# EAGLE schematic yack (EAGLE 6.2)
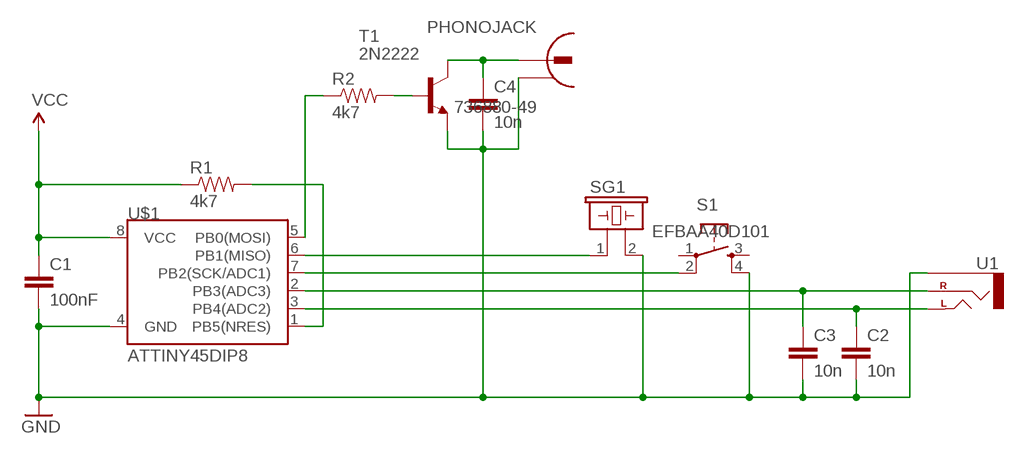
[diagram p0: schematic, sheet 1]

## Parts
C1  100nF  CAPKIT  [CAP-PTH-SMALL-KIT]
C2  10n  CAPKIT  [CAP-PTH-SMALL-KIT]
C3  10n  CAPKIT  [CAP-PTH-SMALL-KIT]
C4  10n  CAPKIT  [CAP-PTH-SMALL-KIT]
PHONOJACK  736880-49  [736880-49]
R1  4k7  RESISTORKIT  [AXIAL-0.3-KIT]
R2  4k7  RESISTORKIT  [AXIAL-0.3-KIT]
S1  TAC_SWITCHPTH  [TACTILE-PTH]
SG1  EFBAA40D101  [EFBAA40D101]
T1  2N2222  [TO92-EBC-OVAL]
U1  AUDIO-JACKPTH  [AUDIO-JACK]
U$1  ATTINY45DIP8  [DIP08]

## Nets
GND: C1.2 C2.2 C3.2 C4.2 PHONOJACK.2 S1.4 SG1.2 T1.E U1.SLEEVE U$1.4(GND)
N$3: R1.P$2 U$1.1(PB5(NRES))
N$4: C3.1 U1.RING(RIGHT) U$1.2(PB3(ADC3))
N$5: C2.1 U1.TIP(LEFT) U$1.3(PB4(ADC2))
N$6: S1.2 U$1.7(PB2(SCK/ADC1))
N$7: SG1.1 U$1.6(PB1(MISO))
N$8: R2.P$1 U$1.5(PB0(MOSI))
N$9: R2.P$2 T1.B
N$10: C4.1 PHONOJACK.1 T1.C
VCC: C1.1 R1.P$1 U$1.8(VCC)
Unconnected: PHONOJACK.2@2 S1.1 S1.3

## Library data of the parts
C1-C4 = SparkFun:CAP: Capacitor Standard 0603 ceramic capacitor, and 0.1" leaded capacitor.
PHONOJACK = con-conrad:736880-49: Cinch Connector ( RCA Jack )
R1 R2 = SparkFun:RESISTOR: Resistor Basic schematic elements and footprints for 0603, 1206, and PTH resistors.
S1 = SparkFun:TAC_SWITCH: Momentary Switch Button commonly used for reset or general input. Spark Fun Electronics SKU : COM-00097
SG1 = buzzer:EFB?: Piezoelectric Acoustic Transducer Source: Panbasonic .. 2SC1685.pdf; OC_FARNELL: unknown; OC_NEWARK: unknown
T1 = adafruit:2N2222: NPN TRANSISTOR Big oval pads
U1 = SparkFun:AUDIO-JACK: 3.5mm Audio Jack Simple 3.5mm common PCB mount audio jack. SKU: PRT-08032
U$1 = SparkFun:ATTINY45: Atmel ATTiny45